# EAGLE schematic snarfbasebasics232-v00 (EAGLE 5.11)
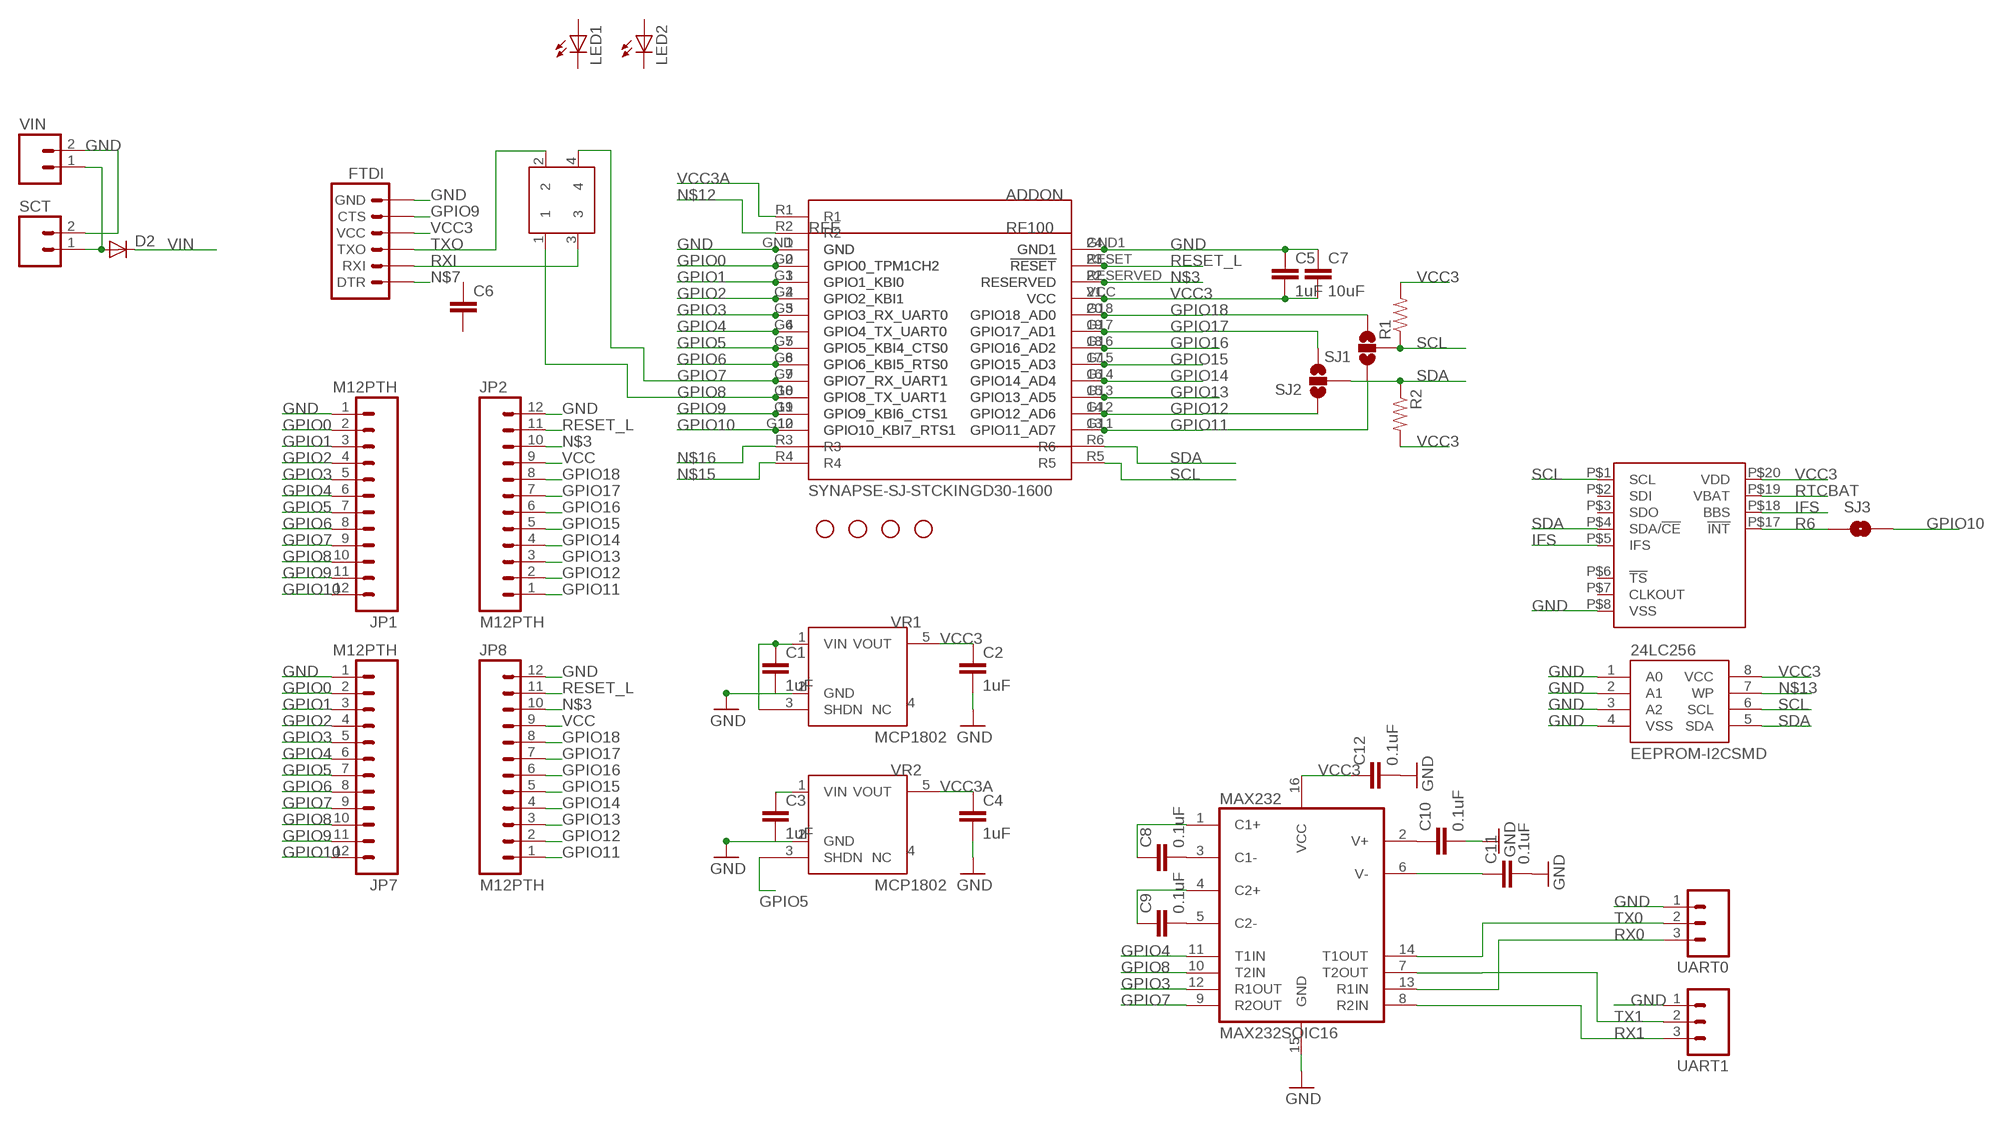
[diagram p0: schematic, sheet 1]

## Parts
24LC256  EEPROM-I2CSMD  [SO08]
ADDON  SYNAPSE-SJ-STCKINGD30-1600  [SYNSJ-STACK]
C1  1uF  CAP0805  [0805]
C2  1uF  CAP0805  [0805]
C3  1uF  CAP0805  [0805]
C4  1uF  CAP0805  [0805]
C5  1uF  CAP0805  [0805]
C6  CAP0805  [0805]
C7  10uF  CAP0805  [0805]
C8  0.1uF  CAP0805  [0805]
C9  0.1uF  CAP0805  [0805]
C10  0.1uF  CAP0805  [0805]
C11  0.1uF  CAP0805  [0805]
C12  0.1uF  CAP0805  [0805]
D2  DIODESMA  [SMA-DIODE]
FTDI  ARDUINO_SERIAL_PROGRAMPTH  [1X06]
JP1  M12PTH  [1X12]
JP2  M12PTH  [1X12]
JP6  STAND-OFF  [STAND-OFF]
JP7  M12PTH  [1X12]
JP8  M12PTH  [1X12]
JP9  STAND-OFF  [STAND-OFF]
JP10  STAND-OFF  [STAND-OFF]
JP11  STAND-OFF  [STAND-OFF]
LED1  LED1206  [LED-1206]
LED2  LED1206  [LED-1206]
MAX232  MAX232SOIC16  [SO016]
PCF2129A  PCF2129ASO20  [SO20W]
R1  RESISTOR  [0805]
R2  RESISTOR  [0805]
RFE  RFE  SYNAPSEWIRELESS-RFENGINESTDTHM  [SYNAPSERFENGINE-THM]
RXTX  SERIAL_CROSSOVER  [2X02_PTH]
SCT  M023.5MM  [SCREWTERMINAL-3.5MM-2]
SJ1  SOLDERJUMPER_2WAYS  [SJ_3]
SJ2  SOLDERJUMPER_2WAYS  [SJ_3]
SJ3  SOLDERJUMPERNC2  [SJ_2S-NOTRACE]
UART0  M03PTH  [1X03]
UART1  M03PTH  [1X03]
VIN  M02PTH  [1X02]
VR1  MCP1802  [SOT23-5]
VR2  MCP1802  [SOT23-5]

## Nets
GND: 24LC256.1(A0) 24LC256.2(A1) 24LC256.3(A2) 24LC256.4(VSS) ADDON.GND ADDON.GND1 C1.2 C2.2 C3.2 C4.2 C5.1 C7.1 C10.2 C11.2 C12.2 FTDI.6(GND) JP1.1 JP2.12 JP7.1 JP8.12 MAX232.15(GND) PCF2129A.P$8(VSS) RFE.1(GND) RFE.24(GND1) SCT.2 UART0.1 UART1.1 VIN.2 VR1.2(GND) VR2.2(GND)
GPIO0: ADDON.G0(GPIO0_TPM1CH2) JP1.2 JP7.2 RFE.2(GPIO0_TPM1CH2)
GPIO1: ADDON.G1(GPIO1_KBI0) JP1.3 JP7.3 RFE.3(GPIO1_KBI0)
GPIO2: ADDON.G2(GPIO2_KBI1) JP1.4 JP7.4 RFE.4(GPIO2_KBI1)
GPIO3: ADDON.G3(GPIO3_RX_UART0) JP1.5 JP7.5 MAX232.12(R1OUT) RFE.5(GPIO3_RX_UART0)
GPIO4: ADDON.G4(GPIO4_TX_UART0) JP1.6 JP7.6 MAX232.11(T1IN) RFE.6(GPIO4_TX_UART0)
GPIO5: ADDON.G5(GPIO5_KBI4_CTS0) JP1.7 JP7.7 RFE.7(GPIO5_KBI4_CTS0) VR2.3(SHDN)
GPIO6: ADDON.G6(GPIO6_KBI5_RTS0) JP1.8 JP7.8 RFE.8(GPIO6_KBI5_RTS0)
GPIO7: ADDON.G7(GPIO7_RX_UART1) JP1.9 JP7.9 MAX232.9(R2OUT) RFE.9(GPIO7_RX_UART1) RXTX.4
GPIO8: ADDON.G8(GPIO8_TX_UART1) JP1.10 JP7.10 MAX232.10(T2IN) RFE.10(GPIO8_TX_UART1) RXTX.1
GPIO9: ADDON.G9(GPIO9_KBI6_CTS1) FTDI.5(CTS) JP1.11 JP7.11 RFE.11(GPIO9_KBI6_CTS1)
GPIO10: ADDON.G10(GPIO10_KBI7_RTS1) JP1.12 JP7.12 RFE.12(GPIO10_KBI7_RTS1) SJ3.2
GPIO11: ADDON.G11(GPIO11_AD7) JP2.1 JP8.1 RFE.13(GPIO11_AD7) SJ1.1
GPIO12: ADDON.G12(GPIO12_AD6) JP2.2 JP8.2 RFE.14(GPIO12_AD6) SJ2.1
GPIO13: ADDON.G13(GPIO13_AD5) JP2.3 JP8.3 RFE.15(GPIO13_AD5)
GPIO14: ADDON.G14(GPIO14_AD4) JP2.4 JP8.4 RFE.16(GPIO14_AD4)
GPIO15: ADDON.G15(GPIO15_AD3) JP2.5 JP8.5 RFE.17(GPIO15_AD3)
GPIO16: ADDON.G16(GPIO16_AD2) JP2.6 JP8.6 RFE.18(GPIO16_AD2)
GPIO17: ADDON.G17(GPIO17_AD1) JP2.7 JP8.7 RFE.19(GPIO17_AD1) SJ2.3
GPIO18: ADDON.G18(GPIO18_AD0) JP2.8 JP8.8 RFE.20(GPIO18_AD0) SJ1.3
IFS: PCF2129A.P$5(IFS) PCF2129A.P$18(BBS)
N$1: C8.2 MAX232.3(C1-)
N$2: D2.A SCT.1 VIN.1
N$3: ADDON.RESERVED JP2.10 JP8.10 RFE.22(RESERVED)
N$4: C9.2 MAX232.5(C2-)
N$5: C10.1 MAX232.2(V+)
N$6: C11.1 MAX232.6(V-)
N$7: FTDI.1(DTR)
N$8: C8.1 MAX232.1(C1+)
N$10: C9.1 MAX232.4(C2+)
N$12: ADDON.R2
N$13: 24LC256.7(WP)
N$15: ADDON.R4
N$16: ADDON.R3
R6: PCF2129A.P$17(!INT) SJ3.1
RESET_L: ADDON.RESET(!RESET) JP2.11 JP8.11 RFE.23(!RESET)
RTCBAT: PCF2129A.P$19(VBAT)
RX0: MAX232.13(R1IN) UART0.3
RX1: MAX232.8(R2IN) UART1.3
RXI: FTDI.2(RXI) RXTX.3
SCL: 24LC256.6(SCL) ADDON.R5 PCF2129A.P$1(SCL) R1.1 SJ1.2
SDA: 24LC256.5(SDA) ADDON.R6 PCF2129A.P$4(SDA/!CE) R2.1 SJ2.2
TX0: MAX232.14(T1OUT) UART0.2
TX1: MAX232.7(T2OUT) UART1.2
TXO: FTDI.3(TXO) RXTX.2
VCC: JP2.9 JP8.9
VCC3: 24LC256.8(VCC) ADDON.VCC C2.1 C5.2 C7.2 C12.1 FTDI.4(VCC) MAX232.16(VCC) PCF2129A.P$20(VDD) R1.2 R2.2 RFE.21(VCC) VR1.5(VOUT)
VCC3A: ADDON.R1 C4.1 VR2.5(VOUT)
VIN: C1.1 C3.1 D2.C VR1.1(VIN) VR1.3(SHDN) VR2.1(VIN)
Unconnected: C6.1 C6.2 LED1.A LED1.C LED2.A LED2.C PCF2129A.P$2(SDI) PCF2129A.P$3(SDO) PCF2129A.P$6(!TS) PCF2129A.P$7(CLKOUT) VR1.4(NC) VR2.4(NC)

## Library data of the parts
24LC256 = SparkFun:EEPROM-I2C
ADDON = 0_jc-custom:SYNAPSE-SJ-STCKING: Standard layout for expansion modules using Synapse Wireless boards
C1-C12 = 0_jc-custom:CAP: Capacitor Standard 0603 ceramic capacitor, and 0.1" leaded capacitor.
D2 = SparkFun:DIODE: Diode These are standard reverse protection diodes and small signal diodes. SMA package can handle up to about 1A. SOD-323 can handle about 200mA. What the SOD-323 package when ordering, there are some mfgs out there that are 5-pin packages.
FTDI = SparkFun:ARDUINO_SERIAL_PROGRAM
JP1 JP2 JP7 JP8 = SparkFun:M12: Header 12 Standard 12-pin 0.1" header. Use with straight break away headers (SKU : PRT-00116), right angle break away headers (PRT-00553), swiss pins (PRT-00743), machine pins (PRT-00117), and female headers (PRT-00115).
JP6 JP9-JP11 = SparkFun:STAND-OFF: Stand Off This is the mechanical footprint for a #4 phillips button head screw. Use the keepout ring to avoid running the screw head into surrounding components. SKU : PRT-00447
LED1 LED2 = SparkFun:LED: LEDs Standard schematic elements and footprints for 5mm, 3mm, 1206, and 0603 sized LEDs. 5mm - Spark Fun Electronics SKU : COM-00529 (and others)
MAX232 = SparkFun:MAX232: RS232 Transceiver Very common IC. This is generically called 'MAX232', but works with the 3V equivalent MAX3232 generic ICs. Field tested and mother approved. Spark Fun Electronics SKU : COM-00316 (DIP) and COM-00589 (SMD)
PCF2129A = 0_jc-custom:PCF2129A
R1 R2 = SparkFun:RESISTOR: Resistor Basic schematic elements and footprints for 0603, 1206, and PTH 1/10th watt (small) resistors.
RFE = 0_jc-custom:SYNAPSEWIRELESS-RFENGINE
RXTX = 0_jc-custom:SERIAL_CROSSOVER
SCT VIN = SparkFun:M02: Header 2 Standard 2-pin 0.1" header. Use with straight break away headers (SKU : PRT-00116), right angle break away headers (PRT-00553), swiss pins (PRT-00743), machine pins (PRT-00117), and female headers (PRT-00115). Molex polarized connector foot print use with SKU : PRT-08233 with associated crimp pins and housings.
SJ1 SJ2 = SparkFun:SOLDERJUMPER_2WAY: Solder Jumper 2 way solder jumper
SJ3 = SparkFun:SOLDERJUMPER: Solder Jumper Standard SMD solder jumper. Used to automate production. Two varients : Normally Open and Normally Closed are the same, but have different paste layers. NC will have a large amount of paste and should jumper during reflow.
UART0 UART1 = SparkFun:M03: Header 3 Standard 3-pin 0.1" header. Use with straight break away headers (SKU : PRT-00116), right angle break away headers (PRT-00553), swiss pins (PRT-00743), machine pins (PRT-00117), and female headers (PRT-00115). Molex polarized connector foot print use with SKU : PRT-08232 with associated crimp pins and housings.
VR1 VR2 = 0_jc-custom:MCP1802

## Net classes
0 default: width 0.356 mm